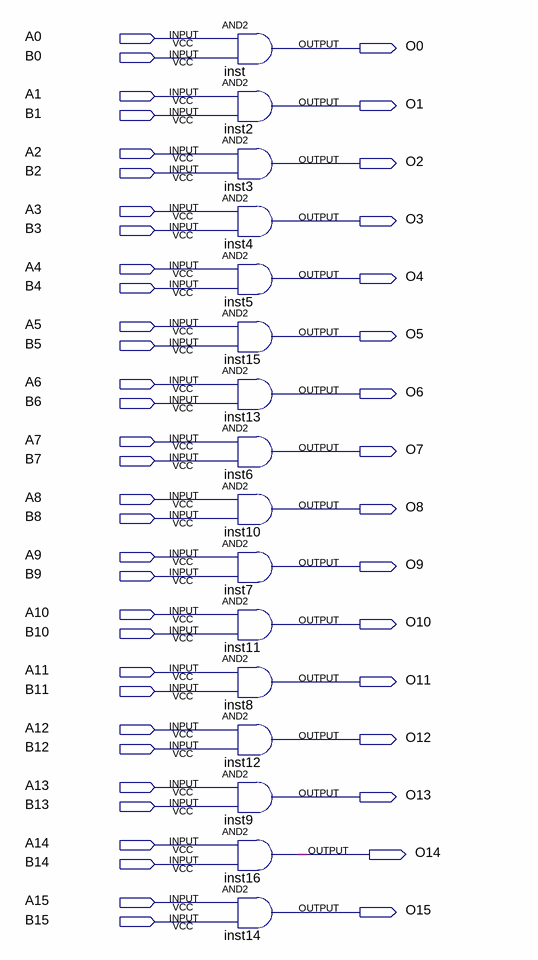
[diagram p0: schematic sheet]
// Quartus schematic And_16bit.bdf as structural Verilog: 16 symbols, 48 pins
module And_16bit (
  input  A0,
  input  B0,
  input  A1,
  input  B1,
  input  A2,
  input  B2,
  input  A3,
  input  B3,
  input  A4,
  input  B4,
  input  A5,
  input  B5,
  input  A6,
  input  B6,
  input  A7,
  input  B7,
  input  A8,
  input  B8,
  input  A9,
  input  B9,
  input  A10,
  input  B10,
  input  A11,
  input  B11,
  input  A12,
  input  B12,
  input  A13,
  input  B13,
  input  A14,
  input  B14,
  input  A15,
  input  B15,
  output O0,
  output O1,
  output O2,
  output O3,
  output O4,
  output O5,
  output O6,
  output O7,
  output O8,
  output O9,
  output O10,
  output O11,
  output O12,
  output O13,
  output O14,
  output O15
);

  and inst (O0, A0, B0);
  and inst2 (O1, A1, B1);
  and inst3 (O2, A2, B2);
  and inst4 (O3, A3, B3);
  and inst5 (O4, A4, B4);
  and inst15 (O5, A5, B5);
  and inst13 (O6, A6, B6);
  and inst6 (O7, A7, B7);
  and inst10 (O8, A8, B8);
  and inst7 (O9, A9, B9);
  and inst11 (O10, A10, B10);
  and inst8 (O11, A11, B11);
  and inst12 (O12, A12, B12);
  and inst9 (O13, A13, B13);
  and inst16 (O14, A14, B14);
  and inst14 (O15, A15, B15);
endmodule
